# Altium schematic sheet Thermistors.SchDoc: Thermistors
size Letter; DocumentNumber: 6; SheetNumber: 10; SheetTotal: 11
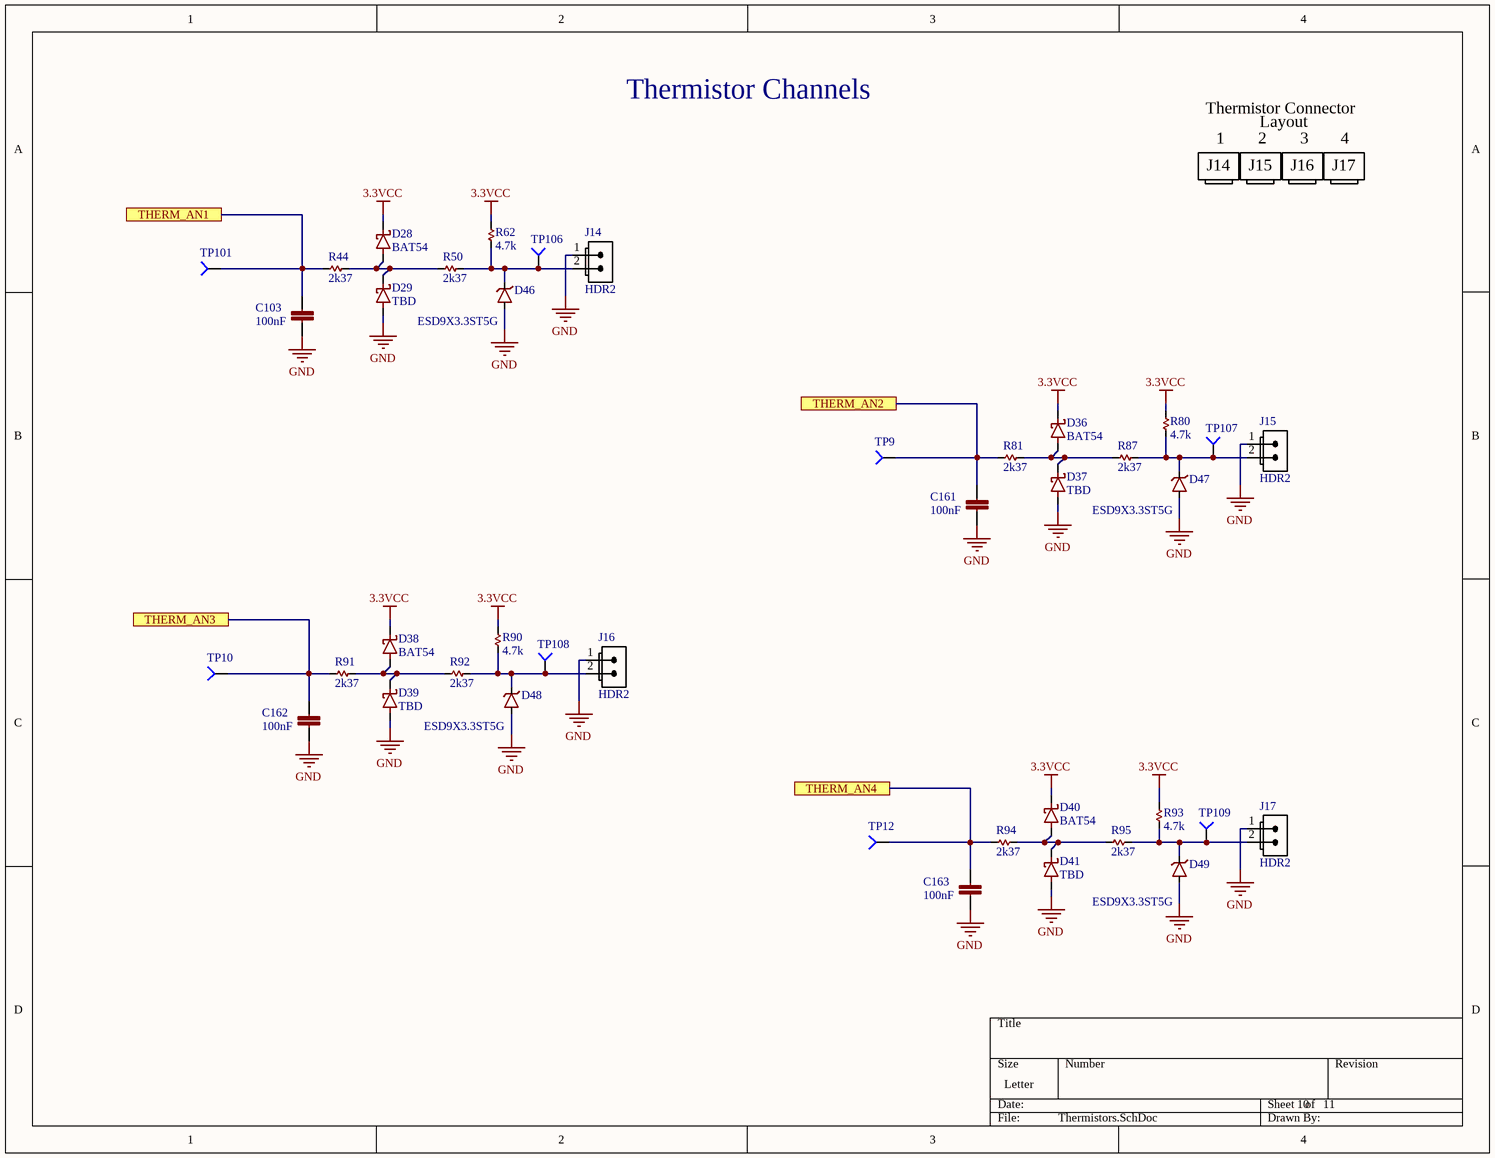
[diagram p0: Thermistors.SchDoc]

## Parts
C103  100nF  [C0402]
C161  100nF  [C0402]
C162  100nF  [C0402]
C163  100nF  [C0402]
D28  BAT54  [SOD523_IPC]
D29  TBD  [SOD523_IPC]
D36  BAT54  [SOD523_IPC]
D37  TBD  [SOD523_IPC]
D38  BAT54  [SOD523_IPC]
D39  TBD  [SOD523_IPC]
D40  BAT54  [SOD523_IPC]
D41  TBD  [SOD523_IPC]
D46  ESD9X3.3ST5G  [SOD923-D]
D47  ESD9X3.3ST5G  [SOD923-D]
D48  ESD9X3.3ST5G  [SOD923-D]
D49  ESD9X3.3ST5G  [SOD923-D]
J14  value HDR2  [70543-01 PIN-IN-PASTE]  (hidden comment: CONN 2PIN VERT 0.1" SHRD LOCKING PIP)
J15  value HDR2  [70543-01 PIN-IN-PASTE]  (hidden comment: CONN 2PIN VERT 0.1" SHRD LOCKING PIP)
J16  value HDR2  [70543-01 PIN-IN-PASTE]  (hidden comment: CONN 2PIN VERT 0.1" SHRD LOCKING PIP)
J17  value HDR2  [70543-01 PIN-IN-PASTE]  (hidden comment: CONN 2PIN VERT 0.1" SHRD LOCKING PIP)
R44  2k37  [R0402]
R50  2k37  [R0402]
R62  4.7k  [R0402]
R80  4.7k  [R0402]
R81  2k37  [R0402]
R87  2k37  [R0402]
R90  4.7k  [R0402]
R91  2k37  [R0402]
R92  2k37  [R0402]
R93  4.7k  [R0402]
R94  2k37  [R0402]
R95  2k37  [R0402]
TP9  TP4  [TP-2]  (value not drawn)  (no BOM)
TP10  TP4  [TP-2]  (value not drawn)  (no BOM)
TP12  TP4  [TP-2]  (value not drawn)  (no BOM)
TP101  TP4  [TP-2]  (value not drawn)  (no BOM)
TP106  TP4  [TP-2]  (value not drawn)  (no BOM)
TP107  TP4  [TP-2]  (value not drawn)  (no BOM)
TP108  TP4  [TP-2]  (value not drawn)  (no BOM)
TP109  TP4  [TP-2]  (value not drawn)  (no BOM)

## Ports
THERM_AN1, THERM_AN2, THERM_AN3, THERM_AN4

## Nets
3.3VCC: D28.K D36.K D38.K D40.K R62.2 R80.2 R90.2 R93.2
GND: C103.2 C161.2 C162.2 C163.2 D29.A D37.A D39.A D41.A D46.A D47.A D48.A D49.A J14.1(S) J15.1(S) J16.1(S) J17.1(S)
THERM_AN1: C103.1 R44.1 TP101.1 ; port THERM_AN1
THERM_AN2: C161.1 R81.1 TP9.1 ; port THERM_AN2
THERM_AN3: C162.1 R91.1 TP10.1 ; port THERM_AN3
THERM_AN4: C163.1 R94.1 TP12.1 ; port THERM_AN4
NetD28_A: D28.A D29.K R44.2 R50.1
NetD36_A: D36.A D37.K R81.2 R87.1
NetD38_A: D38.A D39.K R91.2 R92.1
NetD40_A: D40.A D41.K R94.2 R95.1
NetD46_K: D46.K J14.2(S) R50.2 R62.1 TP106.1
NetD47_K: D47.K J15.2(S) R80.1 R87.2 TP107.1
NetD48_K: D48.K J16.2(S) R90.1 R92.2 TP108.1
NetD49_K: D49.K J17.2(S) R93.1 R95.2 TP109.1

## Notes on the sheet
- Thermistor Channels
- Thermistor Connector
- 1
- 2
- Layout
- 3
- 4
- J14
- J15
- J16
- J17

## Library data of the parts
C103 C161-C163 = GRM155R71C104KA88D: CAP CER 0402 100nF 16V 10% X7R; MANUFACTURER: Murata; PART: 0.1uF 16V X7R 0402; PART DESCRIPTION: 0.10µF ±10% 16V Ceramic Capacitor X7R 0402 (1005 Metric); EE_SPEC: 100nF 16V X7R 0402; VALUE: 100nF; MANUFACTURER #: GRM155R71C104KA88D; DISTRIBUTOR #: 490-3261-2-ND; DISTRIBUTOR: Digi-Key Electronics; TOLERANCE: 10%
D28 D36 D38 D40 = BAT54WX: DIODE SCHOTTKY 30V 200MA SOD523; MANUFACTURER: Diodes Incorporated; MANUFACTURER #: BAT54WX-TP; PART: Schottky Diode; PART DESCRIPTION: Diode Schottky 30V 200mA (DC) Surface Mount SOD-523; TOLERANCE: -NA-; VALUE: BAT54; DISTRIBUTOR #: BAT54WX-TPTR-ND; DISTRIBUTOR: Digi-Key Electronics; EE_SPEC: 30V 200mA
D29 D37 D39 D41 = SOD523_TBD: TOLERANCE: -NA-; MANUFACTURER: TBD; VALUE: TBD; MANUFACTURER #: TBD; EE_SPEC: TBD
D46-D49 = ESD9X3.3ST5G: TVS DIODE 3.3VWM 10.4VC SOD923; MANUFACTURER: On Semi; PART DESCRIPTION: TVS DIODE 3.3VWM SOD923; TOLERANCE: -NA-; VALUE: 3.3V; EE_SPEC: 3.3Vso 15pF; MANUFACTURER #: ESD9X3.3ST5G; DISTRIBUTOR #: ESD9X3.3ST5GOSCT-ND; DISTRIBUTOR: Digikey
J14-J17 = CONN 2PIN VERT 0.1" SHRD LOCKING PIP: Connector 2pos - Pin in Paste; MANUFACTURER: Molex; MANUFACTURER #: 0705430001; PART: 2 Pin Conn; PART DESCRIPTION: 2 Positions Header, Shrouded Connector 0.100" (2.54mm) Through Hole Gold; TOLERANCE: -NA-; DISTRIBUTOR #: WM4800-ND; DISTRIBUTOR: Digikey; EE_SPEC: -NA-
R44 R50 R81 R87 R91 R92 R94 R95 = RC0402FR-072K37L: RES SMD 2.37K OHM 1% 1/16W 0402; MANUFACTURER: Yageo; PART: 2.37k 1% 0402; PART DESCRIPTION: 2.37k Ohm ±1% 0.063W, 1/16W Chip Resistor 0402 (1005 Metric) Moisture Resistant Thick Film; VALUE: 2k37; MANUFACTURER #: RC0402FR-072K37L; DISTRIBUTOR #: 311-2.37KLRTR-ND; DISTRIBUTOR: Digi-Key Electronics; TOLERANCE: 1%; EE_SPEC: 1/16W
R62 R80 R90 R93 = RC0402FR-074K7L: RES SMD 4.7K OHM 1% 1/16W 0402; MANUFACTURER: YAGEO; PART: 4.7k 1% 0402; PART DESCRIPTION: 4.7k Ohm ±1% 0.063W, 1/16W Chip Resistor 0402 (1005 Metric) Moisture Resistant Thick Film; VALUE: 4.7k; MANUFACTURER #: RC0402FR-074K7L; DISTRIBUTOR #: 311-4.7KLRTR-ND; DISTRIBUTOR: Digi-Key Electronics; TOLERANCE: 1%; EE_SPEC: 1/16W
TP9 TP10 TP12 TP101 TP106-TP109 = Socket: MANUFACTURER #: NOTAPART-Testpoint